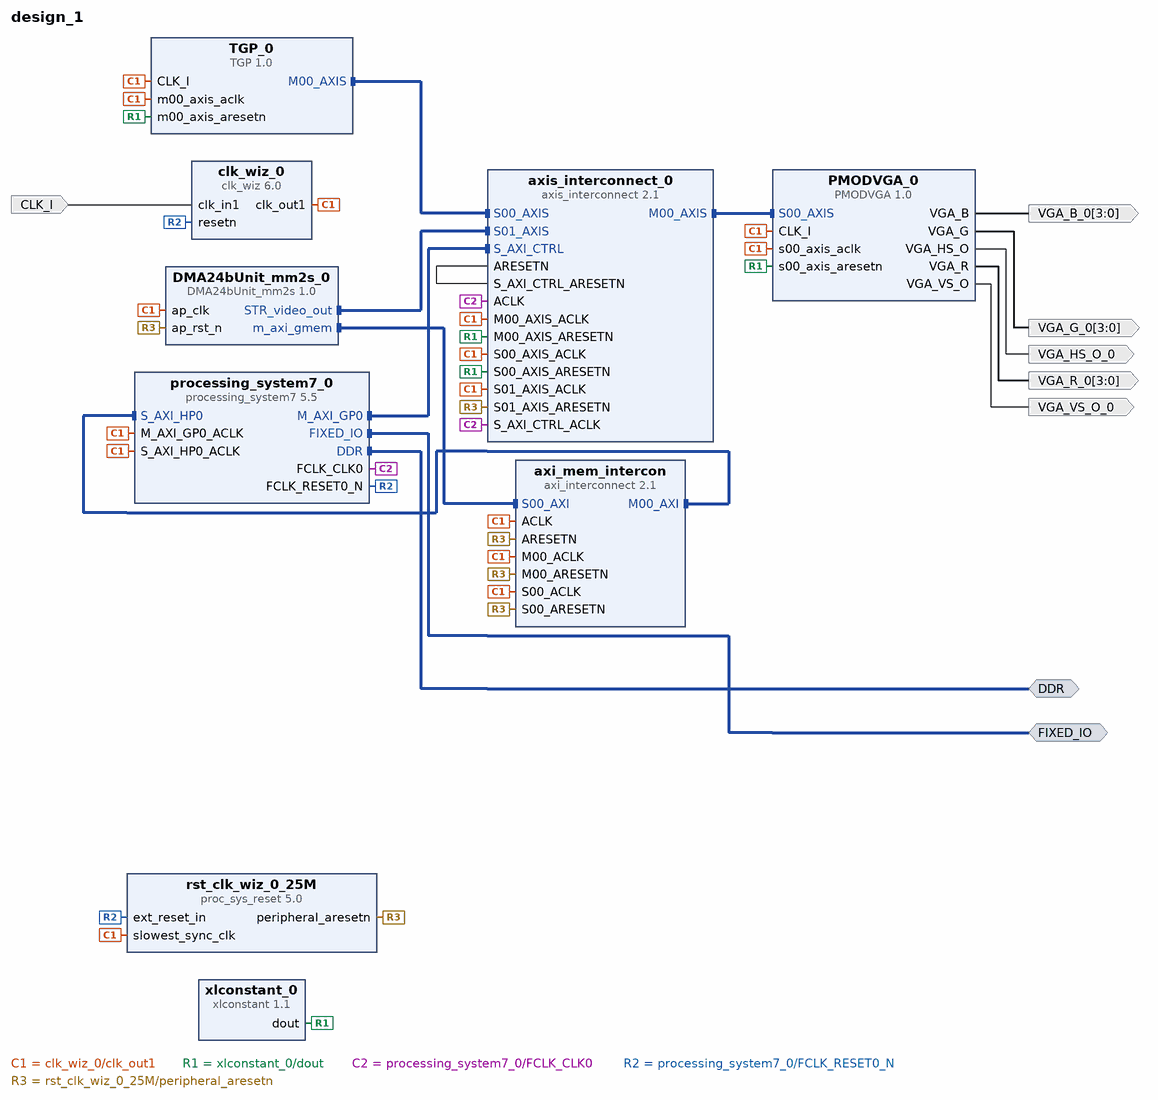
[diagram p0: block diagram of the top level]
# Vivado block design design_1, xc7z010clg400-3, Vivado 2020.2
create_bd_design design_1

create_bd_intf_port -mode Master -vlnv xilinx.com:interface:ddrx_rtl:1.0 DDR
create_bd_intf_port -mode Master -vlnv xilinx.com:display_processing_system7:fixedio_rtl:1.0 FIXED_IO
create_bd_port -dir O -from 3 -to 0 VGA_R_0
create_bd_port -dir O -from 3 -to 0 VGA_B_0
create_bd_port -dir O VGA_VS_O_0
create_bd_port -dir O VGA_HS_O_0
create_bd_port -dir O -from 3 -to 0 VGA_G_0
create_bd_port -dir I -type clk CLK_I
set_property -dict {CONFIG.FREQ_HZ 125000000} [get_bd_ports CLK_I]

create_bd_cell -type ip -vlnv xilinx.com:user:PMODVGA:1.0 PMODVGA_0
create_bd_cell -type ip -vlnv xilinx.com:ip:clk_wiz:6.0 clk_wiz_0
set_property -dict [list \
  CONFIG.CLKIN1_JITTER_PS 80.0 \
  CONFIG.CLKOUT1_DRIVES BUFG \
  CONFIG.CLKOUT1_JITTER 345.102 \
  CONFIG.CLKOUT1_PHASE_ERROR 261.747 \
  CONFIG.CLKOUT1_REQUESTED_OUT_FREQ 25.000 \
  CONFIG.CLKOUT2_DRIVES BUFG \
  CONFIG.CLKOUT3_DRIVES BUFG \
  CONFIG.CLKOUT4_DRIVES BUFG \
  CONFIG.CLKOUT5_DRIVES BUFG \
  CONFIG.CLKOUT6_DRIVES BUFG \
  CONFIG.CLKOUT7_DRIVES BUFG \
  CONFIG.FEEDBACK_SOURCE FDBK_AUTO \
  CONFIG.MMCM_BANDWIDTH OPTIMIZED \
  CONFIG.MMCM_CLKFBOUT_MULT_F 33 \
  CONFIG.MMCM_CLKIN1_PERIOD 8.000 \
  CONFIG.MMCM_CLKIN2_PERIOD 10.0 \
  CONFIG.MMCM_CLKOUT0_DIVIDE_F 33 \
  CONFIG.MMCM_COMPENSATION ZHOLD \
  CONFIG.MMCM_DIVCLK_DIVIDE 5 \
  CONFIG.PRIMITIVE PLL \
  CONFIG.PRIM_IN_FREQ 125.000 \
  CONFIG.RESET_PORT resetn \
  CONFIG.RESET_TYPE ACTIVE_LOW \
  CONFIG.USE_LOCKED false \
] [get_bd_cells clk_wiz_0]
create_bd_cell -type ip -vlnv xilinx.com:ip:processing_system7:5.5 processing_system7_0
set_property -dict {CONFIG.PCW_USE_S_AXI_HP0 1} [get_bd_cells processing_system7_0]
# 2 more settings of processing_system7_0 are not shown: defaults, MIO pin electricals, DDR timing, and values the tool derives
create_bd_cell -type ip -vlnv xilinx.com:user:TGP:1.0 TGP_0
create_bd_cell -type ip -vlnv xilinx.com:ip:axis_interconnect:2.1 axis_interconnect_0
set_property -dict [list \
  CONFIG.ENABLE_ADVANCED_OPTIONS 0 \
  CONFIG.NUM_MI 1 \
  CONFIG.NUM_SI 2 \
  CONFIG.ROUTING_MODE 1 \
] [get_bd_cells axis_interconnect_0]
create_bd_cell -type ip -vlnv xilinx.com:ip:xlconstant:1.1 xlconstant_0
create_bd_cell -type ip -vlnv xilinx.com:hls:DMA24bUnit_mm2s:1.0 DMA24bUnit_mm2s_0
create_bd_cell -type ip -vlnv xilinx.com:ip:axi_interconnect:2.1 axi_mem_intercon
set_property -dict {CONFIG.NUM_MI 1} [get_bd_cells axi_mem_intercon]
create_bd_cell -type ip -vlnv xilinx.com:ip:proc_sys_reset:5.0 rst_clk_wiz_0_25M

# ---- connections ----

connect_bd_intf_net [get_bd_intf_pins DMA24bUnit_mm2s_0/STR_video_out] [get_bd_intf_pins axis_interconnect_0/S01_AXIS]
connect_bd_intf_net [get_bd_intf_ports FIXED_IO] [get_bd_intf_pins processing_system7_0/FIXED_IO]
connect_bd_intf_net [get_bd_intf_pins axis_interconnect_0/M00_AXIS] [get_bd_intf_pins PMODVGA_0/S00_AXIS]
connect_bd_intf_net [get_bd_intf_pins axi_mem_intercon/M00_AXI] [get_bd_intf_pins processing_system7_0/S_AXI_HP0]
connect_bd_intf_net [get_bd_intf_pins DMA24bUnit_mm2s_0/m_axi_gmem] [get_bd_intf_pins axi_mem_intercon/S00_AXI]
connect_bd_intf_net [get_bd_intf_ports DDR] [get_bd_intf_pins processing_system7_0/DDR]
connect_bd_intf_net [get_bd_intf_pins TGP_0/M00_AXIS] [get_bd_intf_pins axis_interconnect_0/S00_AXIS]
connect_bd_intf_net [get_bd_intf_pins processing_system7_0/M_AXI_GP0] [get_bd_intf_pins axis_interconnect_0/S_AXI_CTRL]
connect_bd_net [get_bd_pins PMODVGA_0/VGA_R] [get_bd_ports VGA_R_0]
connect_bd_net [get_bd_pins PMODVGA_0/VGA_B] [get_bd_ports VGA_B_0]
connect_bd_net [get_bd_pins PMODVGA_0/VGA_VS_O] [get_bd_ports VGA_VS_O_0]
connect_bd_net [get_bd_pins PMODVGA_0/VGA_HS_O] [get_bd_ports VGA_HS_O_0]
connect_bd_net [get_bd_pins PMODVGA_0/VGA_G] [get_bd_ports VGA_G_0]
connect_bd_net [get_bd_pins clk_wiz_0/clk_out1] \
  [get_bd_pins PMODVGA_0/CLK_I] [get_bd_pins PMODVGA_0/s00_axis_aclk] [get_bd_pins processing_system7_0/S_AXI_HP0_ACLK] \
  [get_bd_pins processing_system7_0/M_AXI_GP0_ACLK] [get_bd_pins TGP_0/m00_axis_aclk] [get_bd_pins TGP_0/CLK_I] \
  [get_bd_pins axis_interconnect_0/M00_AXIS_ACLK] [get_bd_pins axis_interconnect_0/S00_AXIS_ACLK] \
  [get_bd_pins axi_mem_intercon/M00_ACLK] [get_bd_pins rst_clk_wiz_0_25M/slowest_sync_clk] \
  [get_bd_pins DMA24bUnit_mm2s_0/ap_clk] [get_bd_pins axi_mem_intercon/S00_ACLK] [get_bd_pins axi_mem_intercon/ACLK] \
  [get_bd_pins axis_interconnect_0/S01_AXIS_ACLK]
connect_bd_net -net clk_in1_0_1 [get_bd_ports CLK_I] [get_bd_pins clk_wiz_0/clk_in1]
connect_bd_net -net rst_clk_wiz_0_25M_peripheral_aresetn [get_bd_pins xlconstant_0/dout] \
  [get_bd_pins axis_interconnect_0/M00_AXIS_ARESETN] [get_bd_pins axis_interconnect_0/S00_AXIS_ARESETN] \
  [get_bd_pins PMODVGA_0/s00_axis_aresetn] [get_bd_pins TGP_0/m00_axis_aresetn]
connect_bd_net [get_bd_pins processing_system7_0/FCLK_CLK0] [get_bd_pins axis_interconnect_0/ACLK] [get_bd_pins axis_interconnect_0/S_AXI_CTRL_ACLK]
connect_bd_net [get_bd_pins processing_system7_0/FCLK_RESET0_N] [get_bd_pins clk_wiz_0/resetn] [get_bd_pins rst_clk_wiz_0_25M/ext_reset_in]
connect_bd_net -net rst_ps7_0_50M_peripheral_aresetn [get_bd_pins axis_interconnect_0/ARESETN] [get_bd_pins axis_interconnect_0/S_AXI_CTRL_ARESETN]
connect_bd_net [get_bd_pins rst_clk_wiz_0_25M/peripheral_aresetn] \
  [get_bd_pins axi_mem_intercon/M00_ARESETN] [get_bd_pins DMA24bUnit_mm2s_0/ap_rst_n] \
  [get_bd_pins axi_mem_intercon/S00_ARESETN] [get_bd_pins axi_mem_intercon/ARESETN] \
  [get_bd_pins axis_interconnect_0/S01_AXIS_ARESETN]

# ---- address map ----
assign_bd_address -offset 0x0000000000000000 -range 512M -target_address_space [get_bd_addr_spaces DMA24bUnit_mm2s_0/Data_m_axi_gmem] [get_bd_addr_segs processing_system7_0/S_AXI_HP0/HP0_DDR_LOWOCM]

validate_bd_design
save_bd_design
